# EAGLE design test_2620 (EAGLE 6.1)
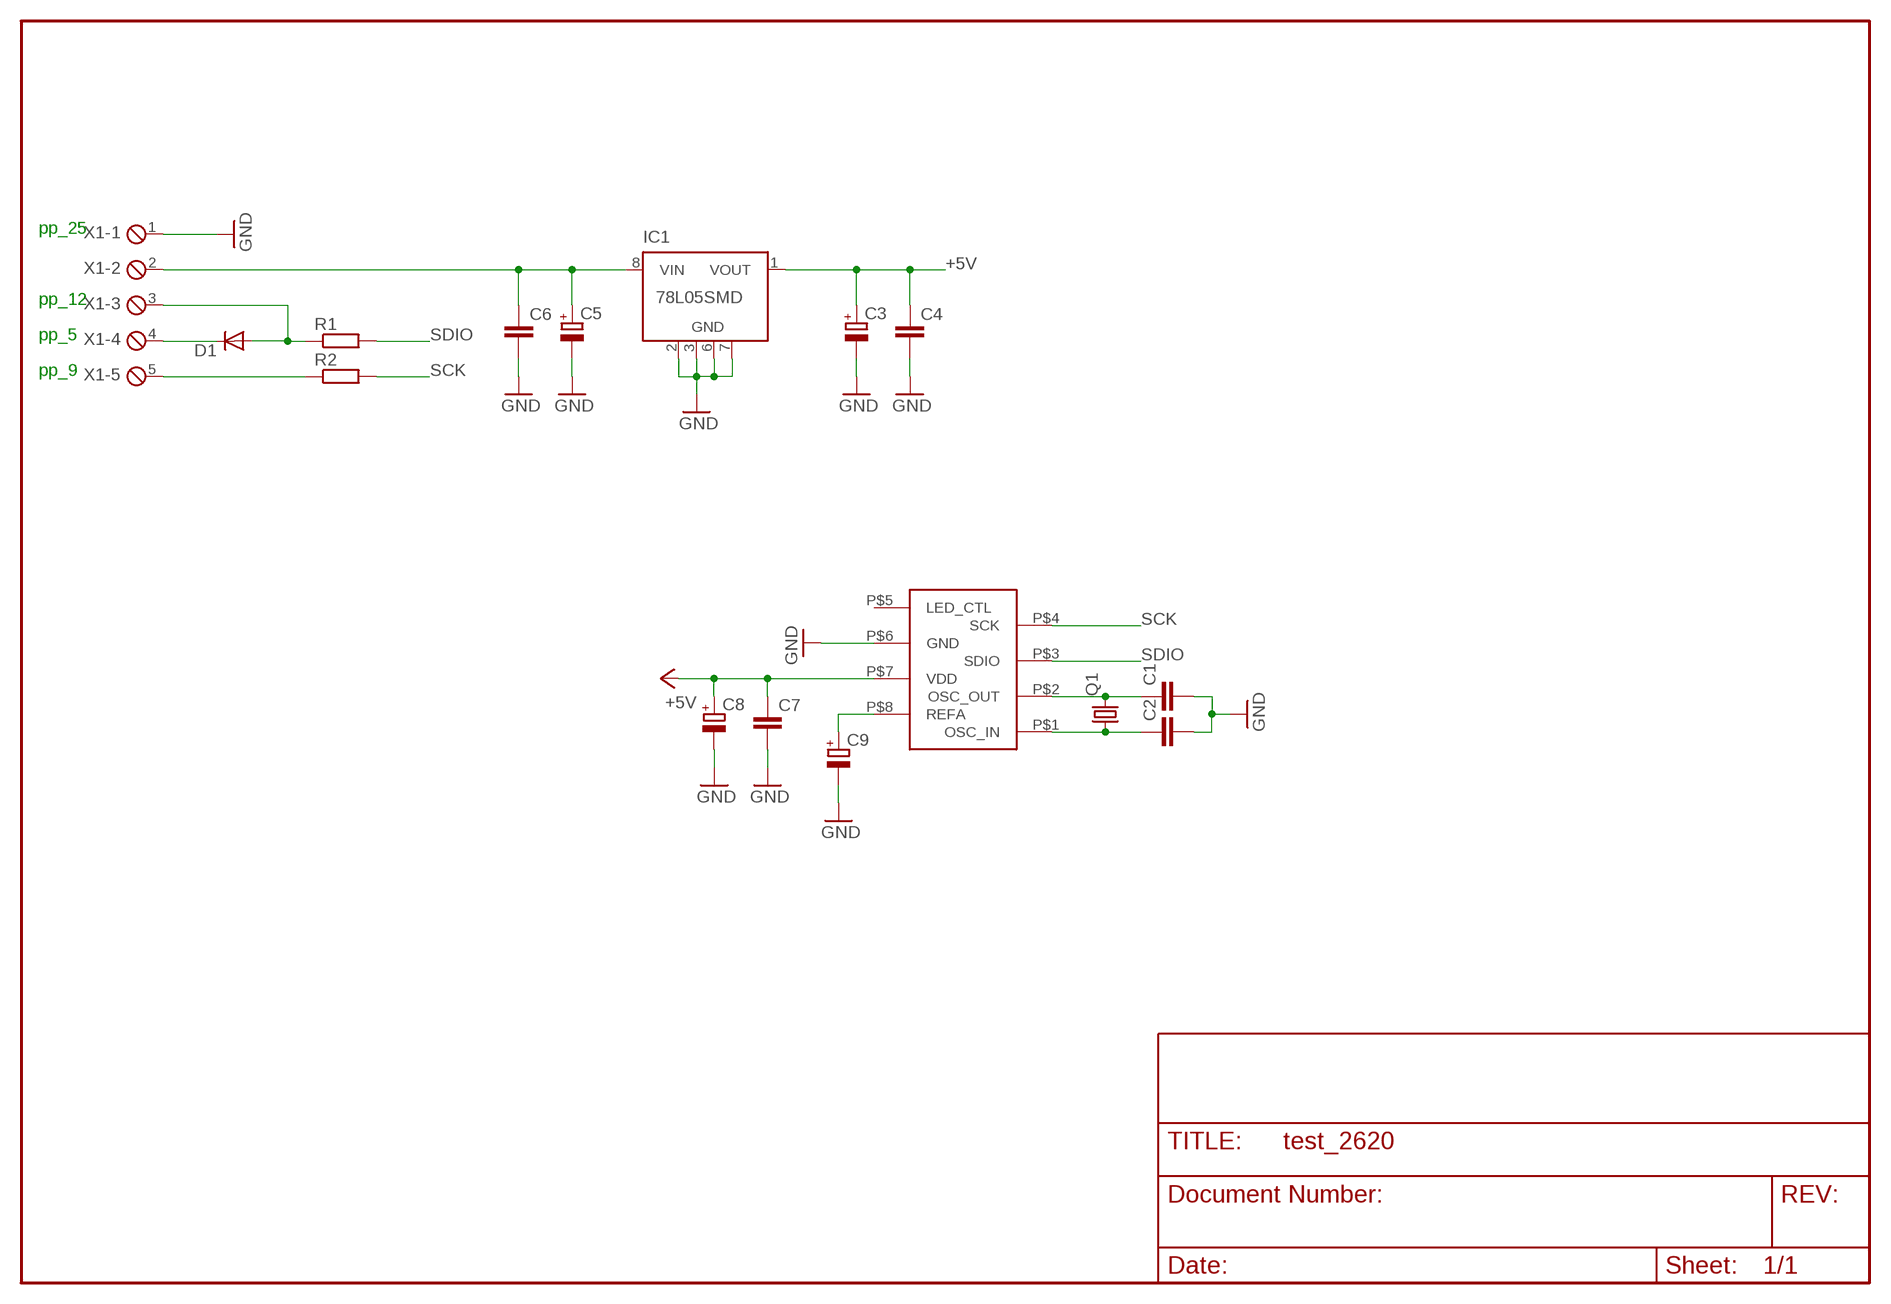
[diagram p0: schematic, sheet 1]

## Parts
C1  C-EUC0805K  [C0805K]
C2  C-EUC0805K  [C0805K]
C3  CPOL-EUSMCC  [SMC_C]
C4  C-EUC0805K  [C0805K]
C5  CPOL-EUSMCC  [SMC_C]
C6  C-EUC0805K  [C0805K]
C7  C-EUC0805K  [C0805K]
C8  CPOL-EUSMCC  [SMC_C]
C9  CPOL-EUSMCC  [SMC_C]
D1  DIODE-MINIMELF  [MINIMELF]
IC1  78L05SMD  [SO08]
Q1  CRYTALHC49U-V  [HC49U-V]
R1  R-EU_R0805  [R0805]
R2  R-EU_R0805  [R0805]
U$1  ADNS2620  [ADNS2620]
X1  MPT5  [5POL254]

## Nets
+5V: C3.+ C4.1 C7.1 C8.+ IC1.1(VOUT) U$1.P$7(VDD)
GND: C1.2 C2.2 C3.- C4.2 C5.- C6.2 C7.2 C8.- C9.- IC1.2(GND) IC1.3(GND) IC1.6(GND) IC1.7(GND) U$1.P$6(GND) X1.1
N$2: C1.1 Q1.2 U$1.P$2(OSC_OUT)
N$3: C2.1 Q1.1 U$1.P$1(OSC_IN)
N$4: C9.+ U$1.P$8(REFA)
N$5: D1.C X1.4
N$7: R2.1 X1.5
N$42: D1.A R1.1 X1.3
SCK: R2.2 U$1.P$4(SCK)
SDIO: R1.2 U$1.P$3(SDIO)
VBAT: C5.+ C6.1 IC1.8(VIN) X1.2
Unconnected: IC1.4(NC) IC1.5(NC) U$1.P$5(LED_CTL)

## Notes on the sheet
- pp_25
- pp_12
- pp_5
- pp_9

## Library data of the parts
C1 C2 C4 C6 C7 = rcl:C-EU: CAPACITOR, European symbol
C3 C5 C8 C9 = rcl:CPOL-EU: POLARIZED CAPACITOR, European symbol
D1 = diode:DIODE-: DIODE
IC1 = linear:78L*SMD: Positive VOLTAGE REGULATOR
Q1 = crystal:CRYTAL: CRYSTAL
R1 R2 = rcl:R-EU_: RESISTOR, European symbol
U$1 = paparazzi:ADNS2620
X1 = con-phoenix-254:MPT5: PHOENIX CONNECTOR

## Board
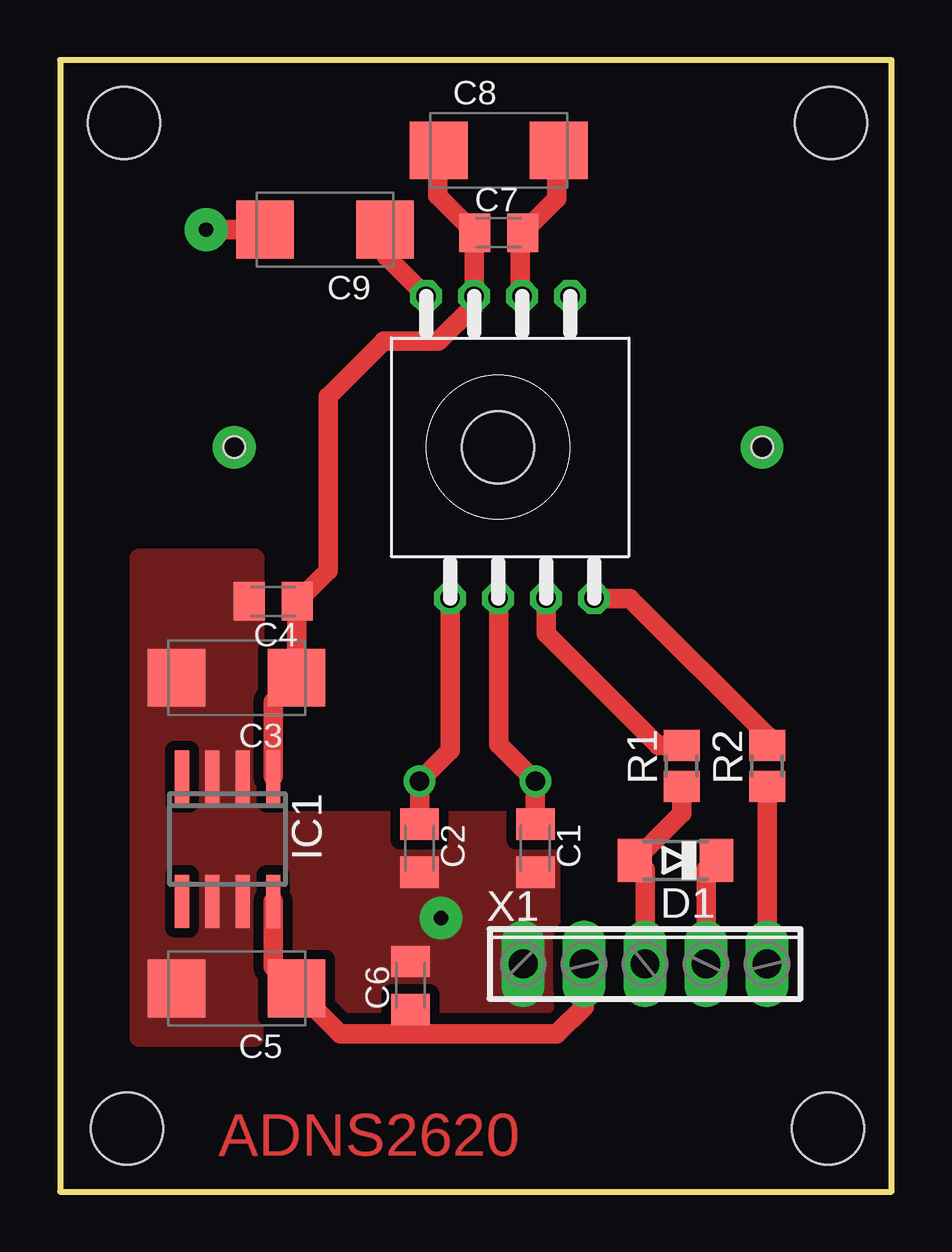
[diagram p1: board, top side]
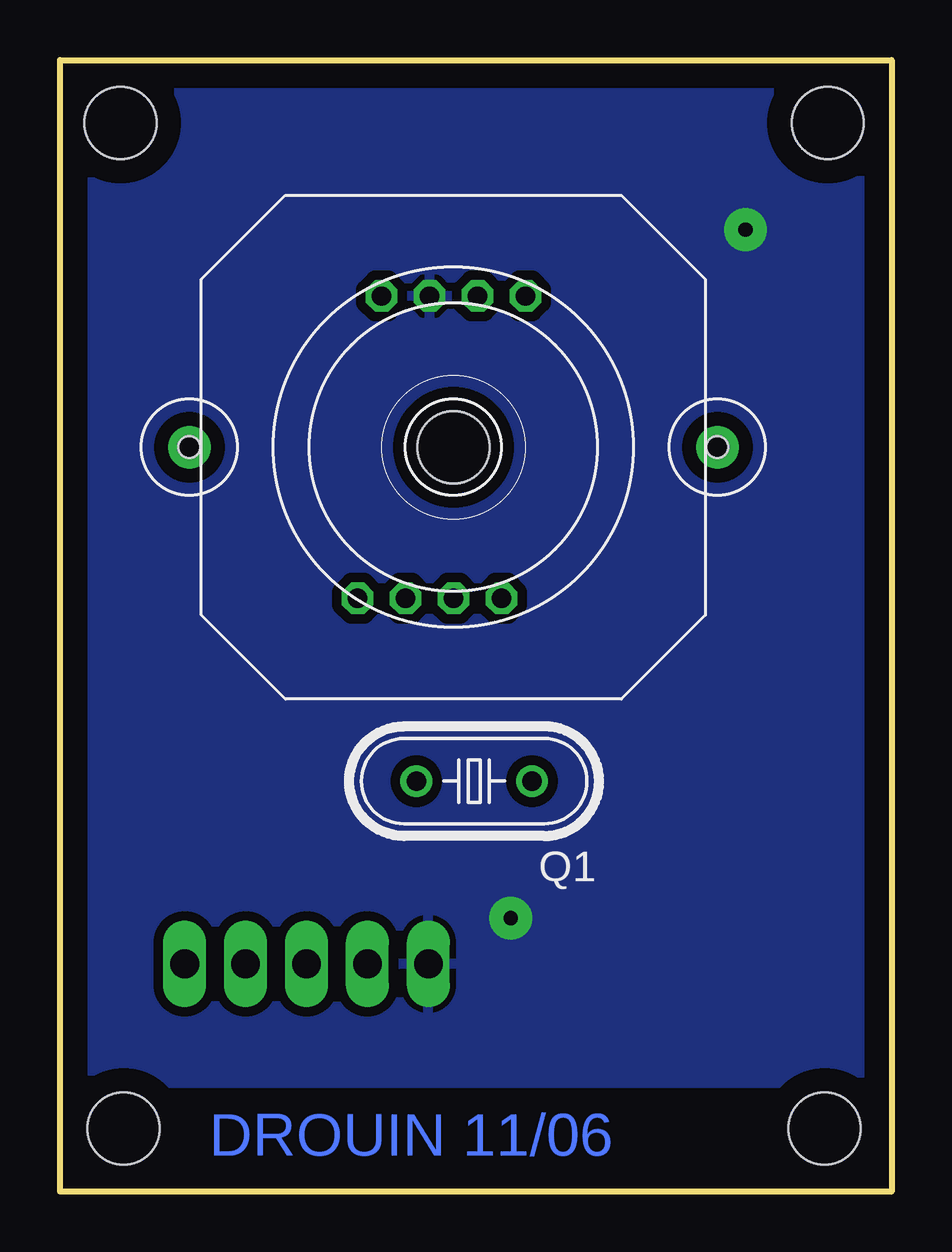
[diagram p2: board, bottom side, seen from below]

Size 34.65 x 47.17 mm. Coordinates in mm from the lower left corner, seen from the top.
Outline: 0,0 34.65,0 34.65,47.17 0,47.17 0,0
Copper layers (1*16): Top 0.035mm / dielectric 1.5mm / Bottom 0.035mm
Design rules: minimum track width 10mil, minimum drill 24mil, track to track 8mil, track to pad 8mil, pad to pad 8mil, via to via 8mil, smd to smd 8mil, copper to edge 40mil, drill to drill 8mil, minimum pad ring 10mil, minimum via ring 8mil, stop-mask expansion 4mil, vias tented up to drill 0mil, thermal gap 10mil
Holes 3 mm at 2.66,44.54 32.13,44.54 2.79,2.63 32,2.63

### Footprints (pad centres in the part's own frame; a part is rotated, then mirrored left to right if it is on the bottom)
C0805K = smd 1.3 x 1.6: 1 -1,0; 2 1,0
SMC_C = smd 2.4 x 2.4: + -2.5,0; - 2.5,0
MINIMELF = smd 1.4 x 1.8: A 1.7,0; C -1.7,0
SO08 = smd 0.6 x 2.2: 1 -1.905,-2.6; 2 -0.635,-2.6; 3 0.635,-2.6; 4 1.905,-2.6; 5 1.905,2.6; 6 0.635,2.6; 7 -0.635,2.6; 8 -1.905,2.6
HC49U-V = drill 0.813: 1 -2.413,0; 2 2.413,0
R0805 = smd 1.3 x 1.5: 1 -0.85,0; 2 0.85,0
ADNS2620 = drill 0.8 octagon: P$1 0,0; P$2 2,0; P$3 4,0; P$4 6,0; P$5 5,12.6; P$6 3,12.6; P$7 1,12.6; P$8 -1,12.6 | hole 3: 2,6.3
CAM_LENS = hole 0.9: -11,0; 11,0
5POL254 = drill 1.2 long: 1 -5.08,0; 2 -2.54,0; 3 0,0; 4 2.54,0; 5 5.08,0

### Placement (x,y rotation side)
C1  19.81,14.31 270 top
C2  14.98,14.31 270 top
C3  7.36,21.42 180 top
C4  8.88,24.6 180 top
C5  7.36,8.47 180 top
C6  14.6,8.6 90 top
C7  18.28,39.97 0 top
C8  18.28,43.4 0 top
C9  11.04,40.09 180 top
D1  25.65,13.8 180 top
IC1  6.98,14.69 180 top
Q1  17.39,17.11 180 bottom
R1  25.9,17.74 90 top
R2  29.46,17.74 90 top
U$1  16.25,24.73 0 top
U$2  [CAM_LENS]  18.26,31.03 0 bottom
X1  24.38,9.49 0 top

### Tracks (layer width: path | path; a pad name or v marks a point on that pad's centre or on a via)
+5V
  Top 0.813: IC1.1 8.88,20.41 9.9,21.42 C3.+ 9.86,24.56 9.9,24.6 C4.1 11.17,25.89 11.17,33.13 13.48,35.45 15.77,35.45 17.25,36.93 17.25,37.41 | 17.25,37.41 17.27,37.43 | 17.25,37.41 U$1.P$7 | 17.25,37.41 17.25,40.08 17.27,40.09 17.28,40.08 C7.1 15.74,41.51 15.74,43.36 C8.+
GND  (via drill 0.6 pad 1.78)
  Top 0.813: v6.09,40.09 C9.- | U$1.P$6 19.17,37.41 19.17,39.97 C7.2 20.7,41.38 20.7,43.4 C8.-
  other vias: 15.87,11.39
  pour Bottom (isolate 0.406): 0.88,46.82 34.03,46.82 34.03,4.53 0.88,4.53
  pour Top (isolate 0.406, no thermals): 8.12,26.38 3.3,26.38 3.3,6.44 8.12,6.44
  pour Top (isolate 0.406, no thermals): 20.44,7.84 7.74,7.84 7.74,15.46 20.44,15.46
N$1  (via drill 0.8 pad 1.78)
  other vias: 2.66,44.54
N$2
  Top 0.406: 18.28,24.73 U$1.P$2 | C1.1 19.81,15.2
  Top 0.813: 18.28,24.73 18.28,18.63 Q1.2 C1.1
N$3
  Top 0.406: C2.1 14.98,15.08
  Top 0.813: U$1.P$1 16.25,18.38 Q1.1 C2.1
N$4
  Top 0.813: C9.+ 13.58,40.05 13.58,38.99 U$1.P$8
N$5
  Top 0.406: D1.C 27.3,13.8 26.92,13.42
  Top 0.813: X1.4 26.92,13.42
N$6  (via drill 0.6)
  other vias: 18.26,31.03
N$7
  Top 0.406: R2.1 29.46,16.98
  Top 0.813: X1.5 R2.1
N$8  (via drill 0.8 pad 1.78)
  other vias: 32.13,44.54
N$9  (via drill 0.8 pad 1.78)
  other vias: 2.79,2.63
N$10  (via drill 0.8 pad 1.78)
  other vias: 32,2.63
N$11  (via drill 0.8 pad 1.78)
  other vias: 7.26,31.03
N$12  (via drill 0.8 pad 1.78)
  other vias: 29.26,31.03
N$42
  Top 0.406: 24,13.8 D1.A
  Top 0.813: D1.A 25.9,15.76 R1.1 | X1.3 24.38,13.42 24,13.8
SCK
  Top 0.406: 29.46,19.01 R2.2
  Top 0.813: U$1.P$4 23.74,24.73 29.46,19.01
SDIO
  Top 0.813: R1.2 24.93,18.59 20.25,23.27 U$1.P$3
VBAT
  Top 0.813: X1.2 21.84,7.71 20.7,6.57 14.6,6.57 | 14.6,6.57 11.68,6.57 9.77,8.47 | C5.+ 9.77,8.47 | IC1.8 8.88,9.36 9.77,8.47 | 14.6,6.57 C6.1

### Text on the board
Top: ADNS2620
Bottom: DROUIN 11/06